# EAGLE design perf_board (EAGLE 7.7.0)
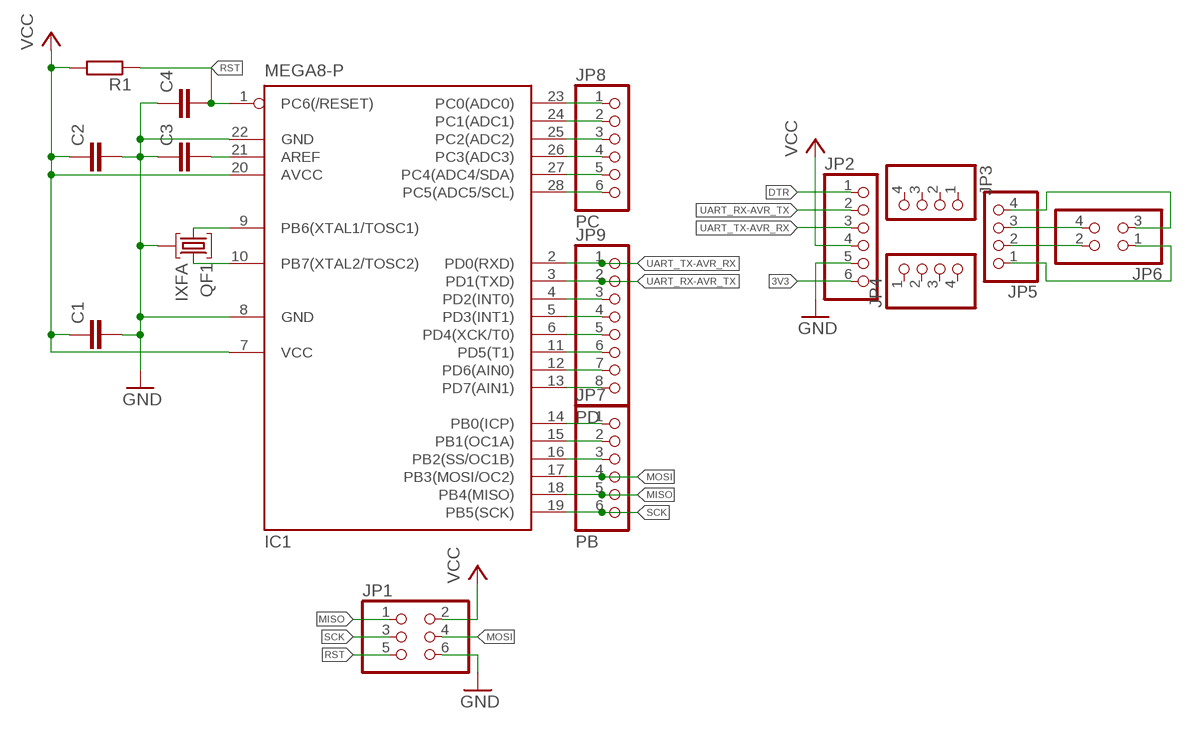
[diagram p0: schematic, sheet 1]

## Parts
C1  C-EUC0603  [C0603]
C2  C-EUC0603  [C0603]
C3  C-EUC0603  [C0603]
C4  C-EUC0603  [C0603]
IC1  MEGA8-P  [DIL28-3]
JP1  PINHD-2X3  [2X03]
JP2  PINHD-1X6  [1X06]
JP3  PINHD-1X4  [1X04]
JP4  PINHD-1X4  [1X04]
JP5  PINHD-1X4  [1X04]
JP6  PINHD-2X2  [2X02]
JP7  PB  PINHD-1X6  [1X06]
JP8  PC  PINHD-1X6  [1X06]
JP9  PD  PINHD-1X8  [1X08]
QF1  IXFA  [HC49U]
R1  R-EU_R0603  [R0603]

## Nets
3V3: JP2.6
DTR: JP2.1
GND: C1.2 C2.2 C3.1 C4.1 IC1.8(GND) IC1.22(GND) JP1.6 JP2.5 QF1.2
MISO: IC1.18(PB4(MISO)) JP1.1 JP7.5
MOSI: IC1.17(PB3(MOSI/OC2)) JP1.4 JP7.4
N$1: C3.2 IC1.21(AREF)
N$2: IC1.9(PB6(XTAL1/TOSC1)) QF1.1
N$3: IC1.10(PB7(XTAL2/TOSC2)) QF1.3
N$4: JP5.2 JP6.2
N$5: JP5.1 JP6.1
N$6: JP5.3 JP6.4
N$7: JP5.4 JP6.3
N$8: IC1.14(PB0(ICP)) JP7.1
N$9: IC1.15(PB1(OC1A)) JP7.2
N$10: IC1.16(PB2(SS/OC1B)) JP7.3
N$11: IC1.4(PD2(INT0)) JP9.3
N$12: IC1.5(PD3(INT1)) JP9.4
N$13: IC1.6(PD4(XCK/T0)) JP9.5
N$14: IC1.11(PD5(T1)) JP9.6
N$15: IC1.12(PD6(AIN0)) JP9.7
N$16: IC1.13(PD7(AIN1)) JP9.8
N$17: IC1.23(PC0(ADC0)) JP8.1
N$18: IC1.24(PC1(ADC1)) JP8.2
N$19: IC1.25(PC2(ADC2)) JP8.3
N$20: IC1.26(PC3(ADC3)) JP8.4
N$21: IC1.27(PC4(ADC4/SDA)) JP8.5
N$22: IC1.28(PC5(ADC5/SCL)) JP8.6
RST: C4.2 IC1.1(PC6(/RESET)) JP1.5 R1.1
SCK: IC1.19(PB5(SCK)) JP1.3 JP7.6
UART_RX-AVR_TX: IC1.3(PD1(TXD)) JP2.2 JP9.2
UART_TX-AVR_RX: IC1.2(PD0(RXD)) JP2.3 JP9.1
VCC: C1.1 C2.1 IC1.7(VCC) IC1.20(AVCC) JP1.2 JP2.4 R1.2
Unconnected: JP3.1 JP3.2 JP3.3 JP3.4 JP4.1 JP4.2 JP4.3 JP4.4

## Library data of the parts
C1-C4 = rcl:C-EU: CAPACITOR, European symbol
IC1 = atmel:MEGA8-P: MICROCONTROLLER 8 Kbytes FLASH, 1 kbytes SRAM, 512 bytes EEPROM, USART, 4-channel 10 bit ADC, 2-channel 8 bit ADC Pin compatible with Atmega48, ATMega88, ATMega168 Source: avr.lbr; OC_FARNELL: unknown; OC_NEWARK: unknown
JP1 = pinhead:PINHD-2X3: PIN HEADER
JP2 JP7 JP8 = pinhead:PINHD-1X6: PIN HEADER
JP3-JP5 = pinhead:PINHD-1X4: PIN HEADER
JP6 = pinhead:PINHD-2X2: PIN HEADER
JP9 = pinhead:PINHD-1X8: PIN HEADER
QF1 = crystal:IXF: Crystal Filter Source: www.ilsiamerica.com .. C1 IXF Series.pdf; OC_FARNELL: unknown; OC_NEWARK: unknown
R1 = rcl:R-EU_: RESISTOR, European symbol

## Board
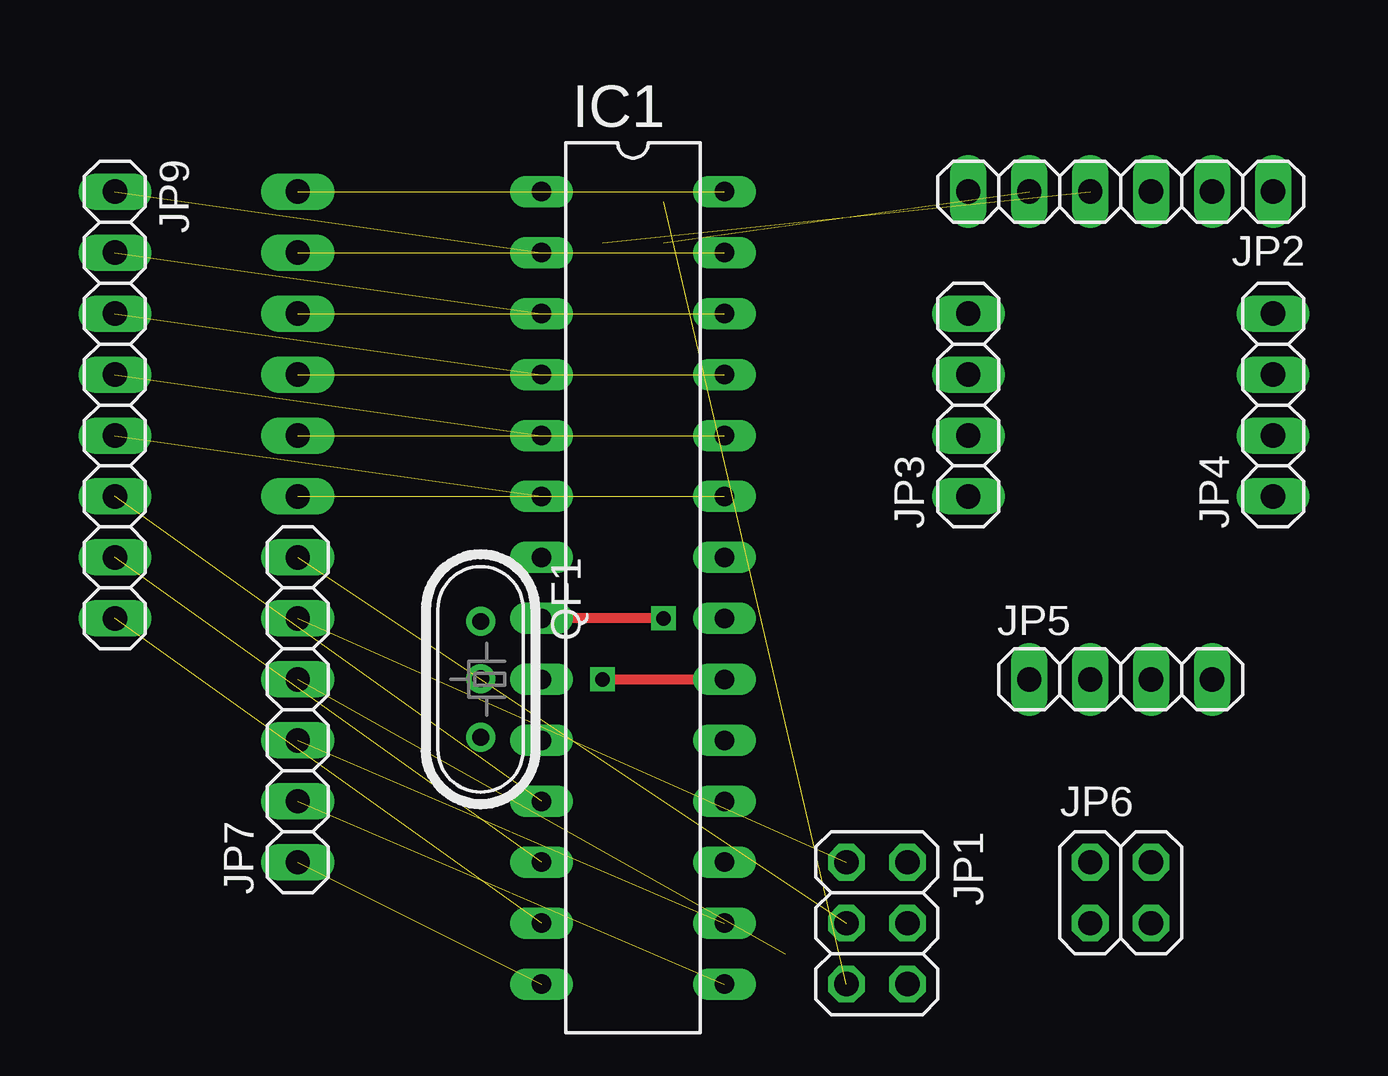
[diagram p1: board, top side]
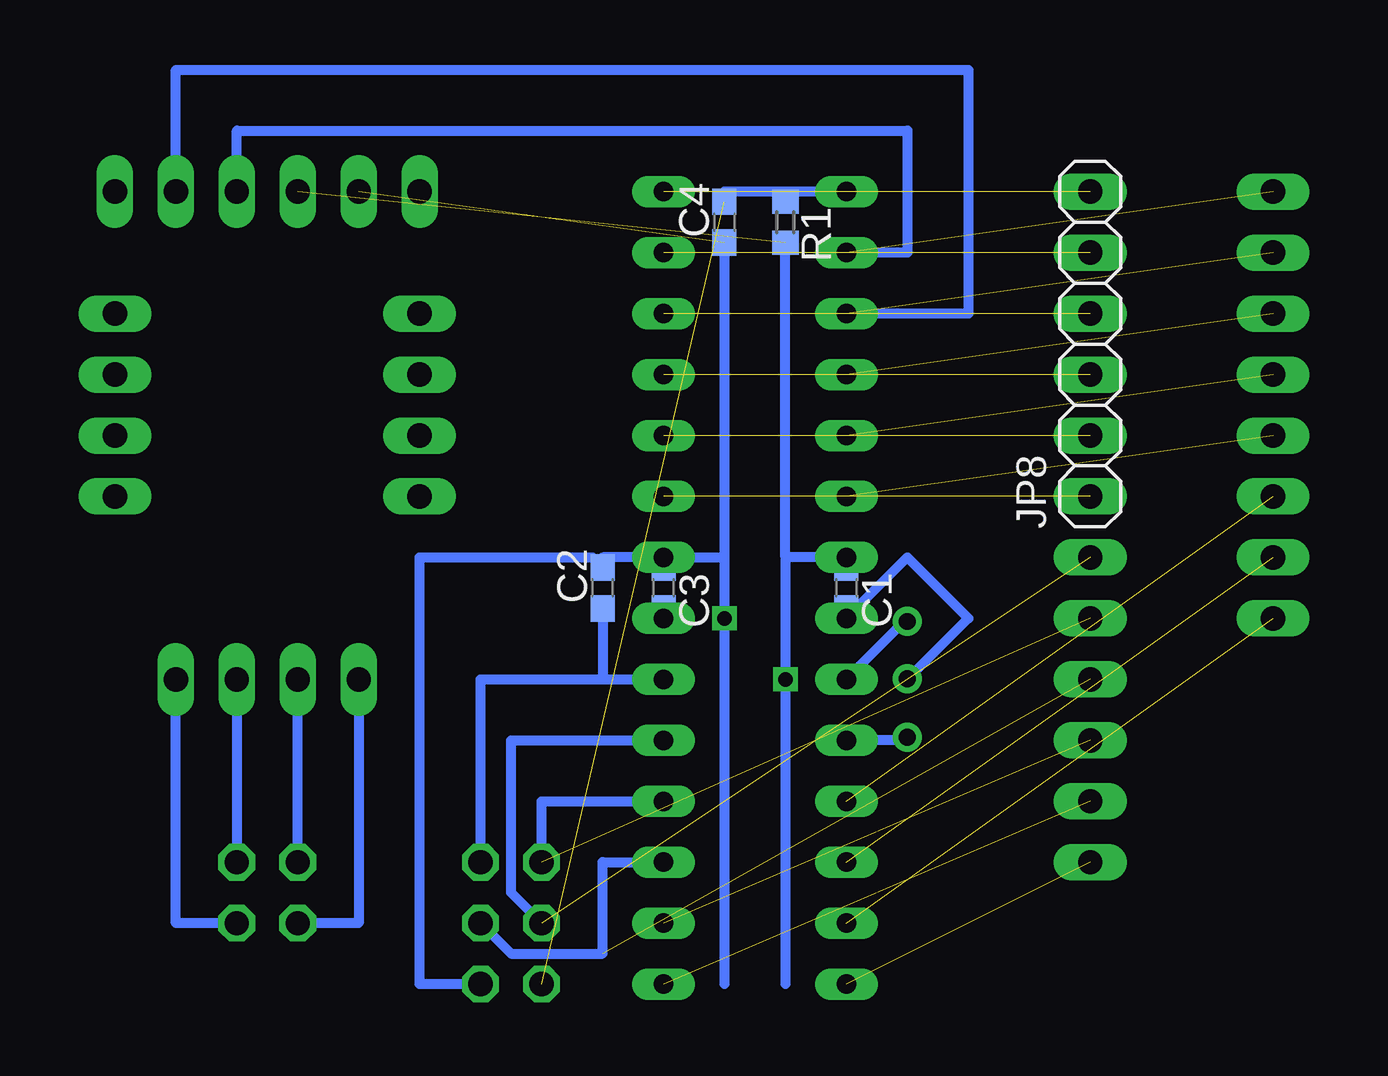
[diagram p2: board, bottom side, seen from below]

No outline drawn. Coordinates in mm, seen from the top.
Copper layers (1*16): Top 0.035mm / dielectric 1.5mm / Bottom 0.035mm
Design rules "default": minimum track width 10mil, minimum drill 24mil, track to track 8mil, track to pad 8mil, pad to pad 8mil, via to via 8mil, smd to smd 8mil, copper to edge 40mil, drill to drill 8mil, minimum pad ring 10mil, minimum via ring 8mil, stop-mask expansion 4mil, vias tented up to drill 0mil, thermal gap 10mil

### Footprints (pad centres in the part's own frame; a part is rotated, then mirrored left to right if it is on the bottom)
C0603 = smd 1.1 x 1: 1 -0.85,0; 2 0.85,0
DIL28-3 = drill 0.813 long: 1 -16.51,-3.81; 2 -13.97,-3.81; 3 -11.43,-3.81; 4 -8.89,-3.81; 5 -6.35,-3.81; 6 -3.81,-3.81; 7 -1.27,-3.81; 8 1.27,-3.81; 9 3.81,-3.81; 10 6.35,-3.81; 11 8.89,-3.81; 12 11.43,-3.81; 13 13.97,-3.81; 14 16.51,-3.81; 15 16.51,3.81; 16 13.97,3.81; 17 11.43,3.81; 18 8.89,3.81; 19 6.35,3.81; 20 3.81,3.81; 21 1.27,3.81; 22 -1.27,3.81; 23 -3.81,3.81; 24 -6.35,3.81; 25 -8.89,3.81; 26 -11.43,3.81; 27 -13.97,3.81; 28 -16.51,3.81
2X03 = drill 1.016 octagon: 1 -2.54,-1.27; 2 -2.54,1.27; 3 0,-1.27; 4 0,1.27; 5 2.54,-1.27; 6 2.54,1.27
1X06 = drill 1.016 long: 1 -6.35,0; 2 -3.81,0; 3 -1.27,0; 4 1.27,0; 5 3.81,0; 6 6.35,0
1X04 = drill 1.016 long: 1 -3.81,0; 2 -1.27,0; 3 1.27,0; 4 3.81,0
2X02 = drill 1.016 octagon: 1 -1.27,-1.27; 2 -1.27,1.27; 3 1.27,-1.27; 4 1.27,1.27
1X08 = drill 1.016 long: 1 -8.89,0; 2 -6.35,0; 3 -3.81,0; 4 -1.27,0; 5 1.27,0; 6 3.81,0; 7 6.35,0; 8 8.89,0
HC49U = drill 0.7 pad 1.2: 1 -2.413,0; 2 -0.027,0; 3 2.413,0
R0603 = smd 1 x 1.1: 1 -0.85,0; 2 0.85,0

### Placement (x,y rotation side)
C1  5.08,21.59 270 bottom
C2  15.24,21.59 90 bottom
C3  12.7,21.59 270 bottom
C4  10.16,36.83 90 bottom
IC1  8.89,21.59 270 top
JP1  19.05,7.62 270 top
JP2  29.21,38.1 180 top
JP3  22.86,29.21 90 top
JP4  35.56,29.21 90 top
JP5  29.21,17.78 0 top
JP6  29.21,8.89 0 top
JP7  -5.08,16.51 90 top
JP8  -5.08,31.75 90 bottom
JP9  -12.7,29.21 270 top
QF1  2.54,17.78 270 top
R1  7.62,36.83 270 bottom

### Tracks (layer width: path | path; a pad name or v marks a point on that pad's centre or on a via)
GND  (via drill 0.6)  (1 unrouted)
  Top 0.406: v10.16,20.32 IC1.8
  Bottom 0.406: C4.1 10.16,22.86 | IC1.22 10.16,22.86 | 10.16,5.08 v10.16,20.32 10.16,22.86 | C1.2 IC1.8 2.54,22.86 0,20.32 2.51,17.81 QF1.2 | C3.1 IC1.22 | IC1.22 15.24,22.86 C2.2 15.66,22.86 22.86,22.86 22.86,5.08 JP1.6
MISO  (1 unrouted)
  Bottom 0.406: JP1.1 17.78,12.7 IC1.18
MOSI  (1 unrouted)
  Bottom 0.406: JP1.4 19.05,6.35 15.24,6.35 15.24,10.16 IC1.17
N$1
  Bottom 0.406: C3.2 IC1.21
N$2
  Bottom 0.406: QF1.1 2.54,20.32 IC1.9
N$3
  Bottom 0.406: QF1.3 2.54,15.24 IC1.10
N$4
  Bottom 0.406: JP6.2 JP5.2
N$5
  Bottom 0.406: JP5.1 25.4,7.62 JP6.1
N$6
  Bottom 0.406: JP5.3 JP6.4
N$7
  Bottom 0.406: JP6.3 33.02,7.62 JP5.4
N$8  (1 unrouted)
N$9  (1 unrouted)
N$10  (1 unrouted)
N$11  (1 unrouted)
N$12  (1 unrouted)
N$13  (1 unrouted)
N$14  (1 unrouted)
N$15  (1 unrouted)
N$16  (1 unrouted)
N$17  (1 unrouted)
N$18  (1 unrouted)
N$19  (1 unrouted)
N$20  (1 unrouted)
N$21  (1 unrouted)
N$22  (1 unrouted)
RST  (1 unrouted)
  Bottom 0.406: IC1.1 7.62,38.1 | R1.1 7.62,38.1 | 7.62,38.1 10.16,38.1 C4.2
SCK  (1 unrouted)
  Bottom 0.406: JP1.3 19.05,8.89 19.05,15.24 IC1.19
UART_RX-AVR_TX  (1 unrouted)
  Bottom 0.406: JP2.2 33.02,43.18 0,43.18 0,33.02 IC1.3
UART_TX-AVR_RX  (1 unrouted)
  Bottom 0.406: JP2.3 30.48,40.64 2.54,40.64 2.54,35.56 IC1.2
VCC  (via drill 0.6)  (1 unrouted)
  Top 0.406: v7.62,17.78 IC1.20
  Bottom 0.406: 7.62,22.86 IC1.7 C1.1 | 7.62,5.08 v7.62,17.78 7.62,22.86 | 7.62,22.86 R1.2 | C2.1 15.24,17.78 | 15.24,17.78 IC1.20 | JP1.2 20.32,17.78 15.24,17.78